# Altium project AD835.PrjPcb
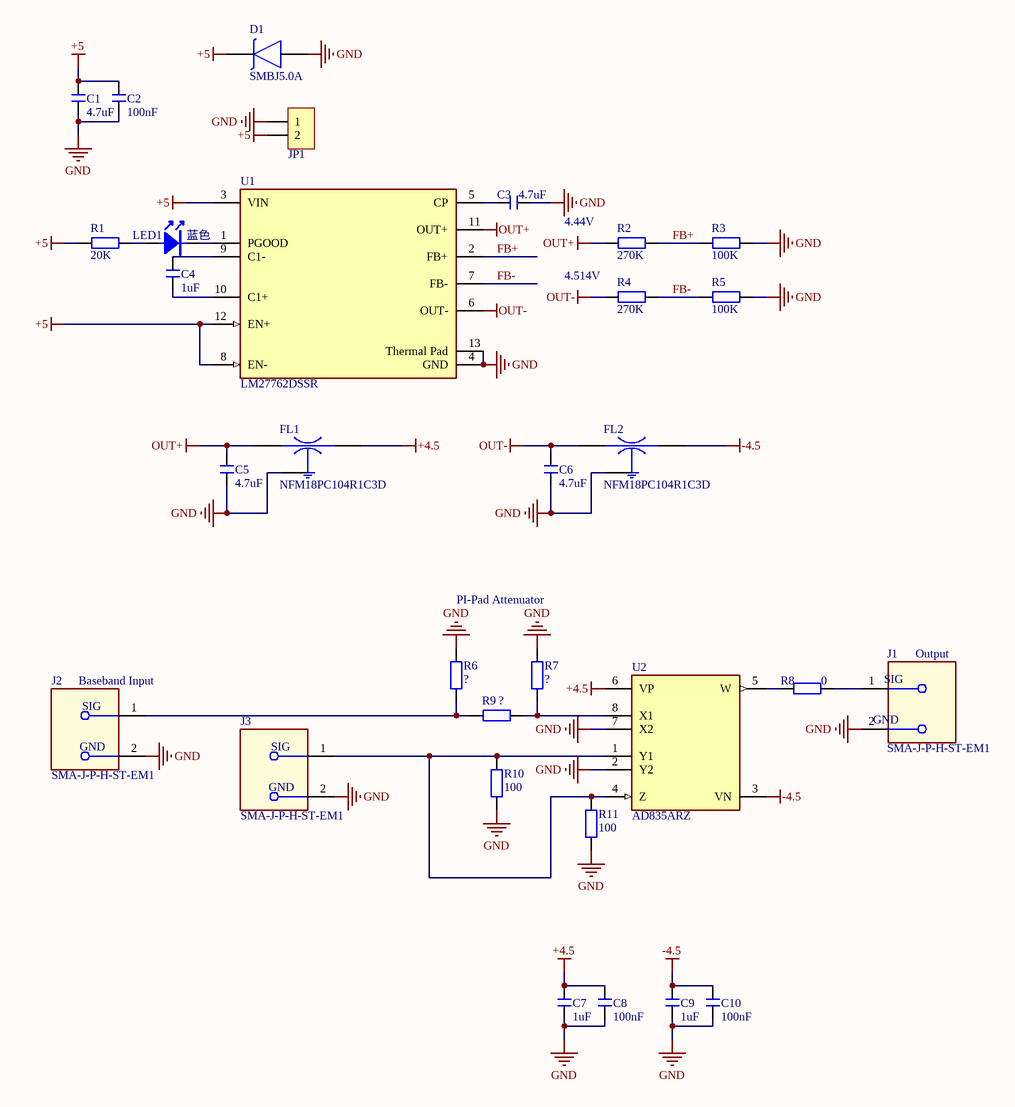
[diagram p0: AD835.SchDoc]
1 sheet, 31 parts. Net scope: global (net labels, ports and power ports of the same name join across sheets).
Board file: AD835.PcbDoc

## Sheet AD835.SchDoc
size A2; SheetNumber: 1; SheetTotal: 1

### Parts
C1  4.7uF  [C 0603_L]
C2  100nF  [C 0603_L]
C3  4.7uF  [C 0603_L]
C4  1uF  [C 0603_L]
C5  4.7uF  [C 0603_L]
C6  4.7uF  [C 0603_L]
C7  1uF  [C 0603_L]
C8  100nF  [C 0603_L]
C9  1uF  [C 0603_L]
C10  100nF  [C 0603_L]
D1  SMBJ5.0A  [SMBJ5.0A]
FL1  NFM18PC104R1C3D  [FIL_NFM18PC104R1C3D]
FL2  NFM18PC104R1C3D  [FIL_NFM18PC104R1C3D]
J1  SMA-J-P-H-ST-EM1  [FP-SMA-J-P-H-ST-EM1-MFG]
J2  SMA-J-P-H-ST-EM1  [FP-SMA-J-P-H-ST-EM1-MFG]
J3  SMA-J-P-H-ST-EM1  [FP-SMA-J-P-H-ST-EM1-MFG]
JP1  HDR-1X2  [KF2510-LI-2P]  (value not drawn)
LED1  蓝色  [LED 0603B]
R1  20K  [R 0603_L]
R2  270K  [R 0603_L]
R3  100K  [R 0603_L]
R4  270K  [R 0603_L]
R5  100K  [R 0603_L]
R6  ?  [R 0603_L]
R7  ?  [R 0603_L]
R8  0  [R 0603_L]
R9  ?  [R 0603_L]
R10  100  [R 0603_L]
R11  100  [R 0603_L]
U1  LM27762DSSR  [FP-DSS0012B-MFG]
U2  AD835ARZ  [FP-R-8-IPC_C]

### Nets
+4.5: C7.2 C8.2 FL1.3(OUT) U2.6(VP)
+5: C1.2 C2.2 D1.1(K) JP1.2 R1.1 U1.3(VIN) U1.8(EN-) U1.12(EN+)
-4.5: C9.2 C10.2 FL2.3(OUT) U2.3(VN)
GND: C1.1 C2.1 C3.1 C5.2 C6.2 C7.1 C8.1 C9.1 C10.1 D1.2(A) FL1.2(GND) FL2.2(GND) J1.2(MNT_1) J2.2(MNT_1) J3.2(MNT_1) JP1.1 R3.2 R5.2 R6.2 R7.2 R10.1 R11.1 U1.4(GND) U1.13(Thermal_Pad) U2.2(Y2) U2.7(X2)
OUT+: C5.1 FL1.1(IN) R2.1 U1.11(OUT+)
OUT-: C6.1 FL2.1(IN) R4.1 U1.6(OUT-)
FB+: R2.2 R3.1 U1.2(FB+)
FB-: R4.2 R5.1 U1.7(FB-)
NetC3_2: C3.2 U1.5(CP)
NetC4_1: C4.1 U1.10(C1+)
NetC4_2: C4.2 U1.9(C1-)
NetJ1_1: J1.1 R8.2
NetJ2_1: J2.1 R6.1 R9.1
NetJ3_1: J3.1 R10.2 R11.2 U2.1(Y1) U2.4(Z)
NetLED1_1: LED1.1(A) R1.2
NetLED1_2: LED1.2(K) U1.1(PGOOD)
NetR7_1: R7.1 R9.2 U2.8(X1)
NetR8_1: R8.1 U2.5(W)

### Notes on the sheet
- (near R2) 4.44V
- 4.514V
- PI-Pad Attenuator
- (near J2) Baseband Input
- (near J1) Output
- (in symbol CMP-02754-000006-1) SIG; GND

### Library data of the parts
C1-C10 = C: 贴片电容; 淘宝ID: 小糖豆的小窝窝; BOM名称: 贴片电容; 下单链接: https://item.taobao.com/item.htm?ft=t&id=613637044352
D1 = SMBJ5.0A: SMBJX.XA Seires TVS; MF: Littelfuse; Package: DO-214 Littelfuse; SnapEDA_Link: https://www.snapeda.com/parts/SMBJ5.0A/Littelfuse+Inc/view-part/?ref=snap; Purchase-URL: https://pricing.snapeda.com/search/part/SMBJ5.0A/?ref=eda; Check_prices: https://www.snapeda.com/parts/SMBJ5.0A/Littelfuse+Inc/view-part/?ref=eda; MP: SMBJ5.0A; Price: None; Availability: In Stock; Value: *
FL1 FL2 = NFM18PC104R1C3D: SMD Capacitor with Capacitance: 0.10uF Tol. 20%. Rated Voltage: 16Vdc; MF: Murata; Digi-Key_Part_Number: 490-6969-1-ND; SnapEDA_Link: https://www.snapeda.com/parts/NFM18PC104R1C3D/Murata/view-part/4375738/?ref=snap; Package: NONSTANDARD; MP: NFM18PC104R1C3D; Digi-Key_Purchase_URL: https://www.digikey.com/product-detail/en/murata-electronics/NFM18PC104R1C3D/490-6969-1-ND/3846166?utm_source=snapeda&utm_medium=aggregator&utm_campaign=symbol; Value: *
J1-J3 = CMP-02754-000006-1: CONN SMA JACK STR 50OHM EDGE MNT; Center Contact Plating: Gold; Voltage Rating: 335V; Impedance: 50R; Max Frequency: 6GHz; Body Material: Brass; Dielectric Material: PTFE; Connector Type: SMA; Series: SMA; Fastening Type: Threaded; Depth: 13.33mm; Max Operating Temperature: 125°C; Termination: Solder; Length: 6.35mm; Radiation Hardening: No; RoHS Compliant: Yes; Insulation Material: Polytetrafluoroethylene; Min Operating Temperature: -65°C; Packaging: Tray; Housing Color: Gold; Body Plating: Gold; Mount: Edge; Contact Material: Copper; Orientation: Straight; Package Quantity: 1; Contact Plating: Gold; Case/Package: SMA
JP1 = Header 2: 2P接插件; 淘宝ID: 小糖豆的小窝窝; BOM名称: 2P接插件; 下单链接: https://item.taobao.com/item.htm?ft=t&id=613637044352
LED1 = LED-SMD: 贴片LED; 淘宝ID: 小糖豆的小窝窝; BOM名称: 贴片LED; 下单链接: https://item.taobao.com/item.htm?ft=t&id=613637044352
R1-R11 = R: 贴片电阻; 淘宝ID: 小糖豆的小窝窝; BOM名称: 贴片电阻; 下单链接: https://item.taobao.com/item.htm?ft=t&id=613637044352
U1 = LM27762DSSR: IC REG CHARGE PUMP ADJ DL 12WSON; Output Current: 250mA; Min Output Voltage: 1.5V; Quiescent Current: 390uA; Max Input Voltage: 5.5V; Output Type: Adjustable; Switching Frequency: 2.3MHz; Max Output Voltage: 5V; Synchronous Rectifier: No; Min Input Voltage: 2.7V; Min Operating Temperature: -40°C; Lead Free: Lead Free; Packaging: Tape and Reel; Max Operating Temperature: 85°C; Topology: Charge Pump; Mount: Surface Mount
U2 = AD835ARZ: ANALOG MULTIPLIER OR DIVIDER, 25; Min Dual Supply Voltage: 4.5V; Number of Amplifiers: 3; Nominal Supply Current: 16mA; Max Dual Supply Voltage: 5.5V; Max Power Dissipation: 300mW; Number of Circuits: 1; Operating Supply Current: 25mA; Number of Channels: 2; Max Input Voltage: 1V; -3db Bandwidth: 250MHz; Dual Supply Voltage: 5V; Slew Rate: 1000V/µs; Accuracy: 2%; Number of Bits: 4; Settling Time: 20ns; Output Voltage: 2.5V; Contact Plating: Tin; Height: 1.5mm; Number of Elements: 1; Min Supply Voltage: 4.5V; Mount: Surface Mount; Operating Supply Voltage: 5V; Package Quantity: 1; Max Frequency: 250MHz; Lead Free: Contains Lead; Length: 5mm; Min Operating Temperature: -40°C; Supply Current: 16mA; Max Operating Temperature: 85°C; Width: 4mm; Max Supply Voltage: 5.5V; RoHS Compliant: Yes; Radiation Hardening: No; REACH SVHC: No SVHC; Series: -; Number of Pins: 8; Case/Package: SOIC; Packaging: Rail/Tube